# Altium schematic sheet AVR Board 4.0 FTDI Ports.SchDoc
size A
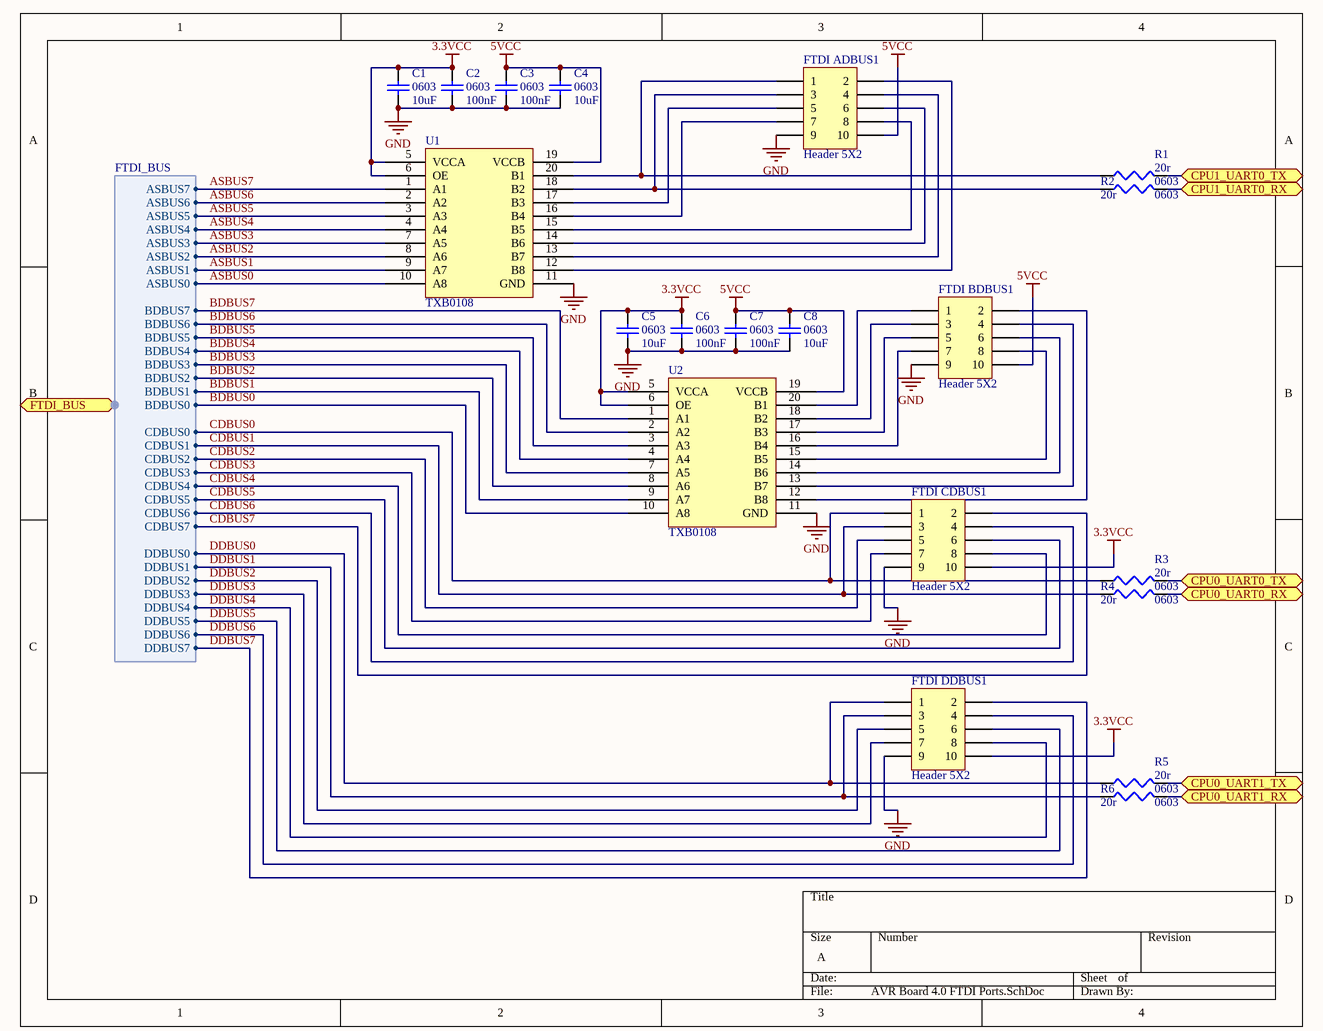
[diagram p0: AVR Board 4.0 FTDI Ports.SchDoc]

## Parts
C1  0603  value 10uF  [1608[0603]]
C2  0603  value 100nF  [1608[0603]]
C3  0603  value 100nF  [1608[0603]]
C4  0603  value 10uF  [1608[0603]]
C5  0603  value 10uF  [1608[0603]]
C6  0603  value 100nF  [1608[0603]]
C7  0603  value 100nF  [1608[0603]]
C8  0603  value 10uF  [1608[0603]]
FTDI_ADBUS1  Header 5X2  [HDR2X5]
FTDI_BDBUS1  Header 5X2  [HDR2X5]
FTDI_CDBUS1  Header 5X2  [HDR2X5]
FTDI_DDBUS1  Header 5X2  [HDR2X5]
R1  0603  value 20r  [J1-0603]
R2  0603  value 20r  [J1-0603]
R3  0603  value 20r  [J1-0603]
R4  0603  value 20r  [J1-0603]
R5  0603  value 20r  [J1-0603]
R6  0603  value 20r  [J1-0603]
U1  TXB0108  [TXB0108]
U2  TXB0108  [TXB0108]

## Ports
CPU0_UART0_RX, CPU0_UART0_TX, CPU0_UART1_RX, CPU0_UART1_TX, CPU1_UART0_RX, CPU1_UART0_TX, FTDI_BUS (harness FTDI_BUS)

## Harnesses
FTDI_BUS: BDBUS0, BDBUS1, BDBUS2, BDBUS3, BDBUS4, BDBUS5, BDBUS6, BDBUS7, CDBUS0, CDBUS1, CDBUS2, CDBUS3, CDBUS4, CDBUS5, CDBUS6, CDBUS7, DDBUS0, DDBUS1, DDBUS2, DDBUS3, DDBUS4, DDBUS5, DDBUS6, DDBUS7, ASBUS0, ASBUS1, ASBUS2, ASBUS3, ASBUS4, ASBUS5, ASBUS6, ASBUS7

## Nets
3.3VCC: C1.2 C2.2 C5.2 C6.2 FTDI_CDBUS1.10 FTDI_DDBUS1.10 U1.5(VCCA) U1.6(OE) U2.5(VCCA) U2.6(OE)
5VCC: C3.2 C4.2 C7.2 C8.2 FTDI_ADBUS1.10 FTDI_BDBUS1.10 U1.19(VCCB) U2.19(VCCB)
GND: C1.1 C2.1 C3.1 C4.1 C5.1 C6.1 C7.1 C8.1 FTDI_ADBUS1.9 FTDI_BDBUS1.9 FTDI_CDBUS1.9 FTDI_DDBUS1.9 U1.11(GND) U2.11(GND)
ASBUS0: U1.10(A8) ; port FTDI_BUS.ASBUS0
ASBUS1: U1.9(A7) ; port FTDI_BUS.ASBUS1
ASBUS2: U1.8(A6) ; port FTDI_BUS.ASBUS2
ASBUS3: U1.7(A5) ; port FTDI_BUS.ASBUS3
ASBUS4: U1.4(A4) ; port FTDI_BUS.ASBUS4
ASBUS5: U1.3(A3) ; port FTDI_BUS.ASBUS5
ASBUS6: U1.2(A2) ; port FTDI_BUS.ASBUS6
ASBUS7: U1.1(A1) ; port FTDI_BUS.ASBUS7
BDBUS0: U2.10(A8) ; port FTDI_BUS.BDBUS0
BDBUS1: U2.9(A7) ; port FTDI_BUS.BDBUS1
BDBUS2: U2.8(A6) ; port FTDI_BUS.BDBUS2
BDBUS3: U2.7(A5) ; port FTDI_BUS.BDBUS3
BDBUS4: U2.4(A4) ; port FTDI_BUS.BDBUS4
BDBUS5: U2.3(A3) ; port FTDI_BUS.BDBUS5
BDBUS6: U2.2(A2) ; port FTDI_BUS.BDBUS6
BDBUS7: U2.1(A1) ; port FTDI_BUS.BDBUS7
CDBUS0: FTDI_CDBUS1.1 R3.1 ; port FTDI_BUS.CDBUS0
CDBUS1: FTDI_CDBUS1.3 R4.1 ; port FTDI_BUS.CDBUS1
CDBUS2: FTDI_CDBUS1.5 ; port FTDI_BUS.CDBUS2
CDBUS3: FTDI_CDBUS1.7 ; port FTDI_BUS.CDBUS3
CDBUS4: FTDI_CDBUS1.8 ; port FTDI_BUS.CDBUS4
CDBUS5: FTDI_CDBUS1.6 ; port FTDI_BUS.CDBUS5
CDBUS6: FTDI_CDBUS1.4 ; port FTDI_BUS.CDBUS6
CDBUS7: FTDI_CDBUS1.2 ; port FTDI_BUS.CDBUS7
CPU0_UART0_RX: R4.2 ; port CPU0_UART0_RX
CPU0_UART0_TX: R3.2 ; port CPU0_UART0_TX
CPU0_UART1_RX: R6.2 ; port CPU0_UART1_RX
CPU0_UART1_TX: R5.2 ; port CPU0_UART1_TX
CPU1_UART0_RX: R2.2 ; port CPU1_UART0_RX
CPU1_UART0_TX: R1.2 ; port CPU1_UART0_TX
DDBUS0: FTDI_DDBUS1.1 R5.1 ; port FTDI_BUS.DDBUS0
DDBUS1: FTDI_DDBUS1.3 R6.1 ; port FTDI_BUS.DDBUS1
DDBUS2: FTDI_DDBUS1.5 ; port FTDI_BUS.DDBUS2
DDBUS3: FTDI_DDBUS1.7 ; port FTDI_BUS.DDBUS3
DDBUS4: FTDI_DDBUS1.8 ; port FTDI_BUS.DDBUS4
DDBUS5: FTDI_DDBUS1.6 ; port FTDI_BUS.DDBUS5
DDBUS6: FTDI_DDBUS1.4 ; port FTDI_BUS.DDBUS6
DDBUS7: FTDI_DDBUS1.2 ; port FTDI_BUS.DDBUS7
NetFTDI_ADBUS1_1: FTDI_ADBUS1.1 R1.1 U1.20(B1)
NetFTDI_ADBUS1_2: FTDI_ADBUS1.2 U1.12(B8)
NetFTDI_ADBUS1_3: FTDI_ADBUS1.3 R2.1 U1.18(B2)
NetFTDI_ADBUS1_4: FTDI_ADBUS1.4 U1.13(B7)
NetFTDI_ADBUS1_5: FTDI_ADBUS1.5 U1.17(B3)
NetFTDI_ADBUS1_6: FTDI_ADBUS1.6 U1.14(B6)
NetFTDI_ADBUS1_7: FTDI_ADBUS1.7 U1.16(B4)
NetFTDI_ADBUS1_8: FTDI_ADBUS1.8 U1.15(B5)
NetFTDI_BDBUS1_1: FTDI_BDBUS1.1 U2.20(B1)
NetFTDI_BDBUS1_2: FTDI_BDBUS1.2 U2.12(B8)
NetFTDI_BDBUS1_3: FTDI_BDBUS1.3 U2.18(B2)
NetFTDI_BDBUS1_4: FTDI_BDBUS1.4 U2.13(B7)
NetFTDI_BDBUS1_5: FTDI_BDBUS1.5 U2.17(B3)
NetFTDI_BDBUS1_6: FTDI_BDBUS1.6 U2.14(B6)
NetFTDI_BDBUS1_7: FTDI_BDBUS1.7 U2.16(B4)
NetFTDI_BDBUS1_8: FTDI_BDBUS1.8 U2.15(B5)

## Library data of the parts
C1-C8 = Cap Semi: Capacitor (Semiconductor SIM Model); Published: 8-Jun-2000; LatestRevisionDate: 29-May-2009; LatestRevisionNote: IPC-7351 Footprint Added.; PackageReference: C1206; Publisher: Altium Limited; PackageDescription: Chip Capacitor
FTDI_ADBUS1 FTDI_BDBUS1 FTDI_CDBUS1 FTDI_DDBUS1 = Header 5X2: Header, 5-Pin, Dual row; LatestRevisionDate: 17-Jul-2002; LatestRevisionNote: Re-released for DXP Platform.; Publisher: Altium Limited
R1-R6 = Res3: Resistor; Published: 8-Jun-2000; LatestRevisionDate: 29-May-2009; LatestRevisionNote: IPC-7351 Footprint Added.; PackageReference: J1-0603; Publisher: Altium Limited; PackageDescription: Chip Resistor
U1 U2 = TXB0108: Ti TXB0108 Bidirectional Level Translator